# EAGLE design addr-bl (EAGLE 7.5.0)
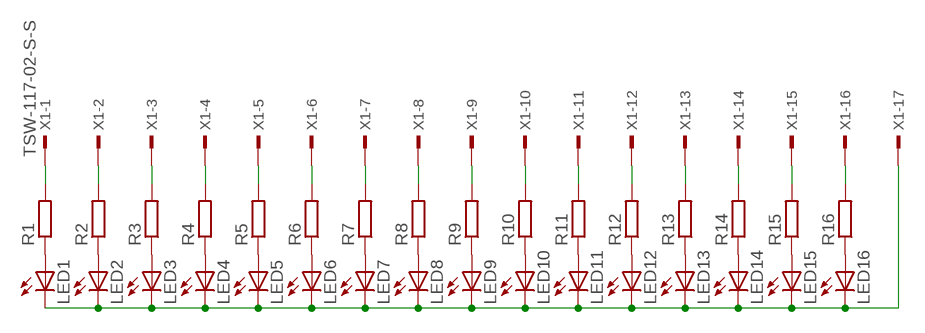
[diagram p0: schematic, sheet 1]

## Parts
LED1  LEDSMT1206  [1206]
LED2  LEDSMT1206  [1206]
LED3  LEDSMT1206  [1206]
LED4  LEDSMT1206  [1206]
LED5  LEDSMT1206  [1206]
LED6  LEDSMT1206  [1206]
LED7  LEDSMT1206  [1206]
LED8  LEDSMT1206  [1206]
LED9  LEDSMT1206  [1206]
LED10  LEDSMT1206  [1206]
LED11  LEDSMT1206  [1206]
LED12  LEDSMT1206  [1206]
LED13  LEDSMT1206  [1206]
LED14  LEDSMT1206  [1206]
LED15  LEDSMT1206  [1206]
LED16  LEDSMT1206  [1206]
R1  R-EU_M1206  [M1206]
R2  R-EU_M1206  [M1206]
R3  R-EU_M1206  [M1206]
R4  R-EU_M1206  [M1206]
R5  R-EU_M1206  [M1206]
R6  R-EU_M1206  [M1206]
R7  R-EU_M1206  [M1206]
R8  R-EU_M1206  [M1206]
R9  R-EU_M1206  [M1206]
R10  R-EU_M1206  [M1206]
R11  R-EU_M1206  [M1206]
R12  R-EU_M1206  [M1206]
R13  R-EU_M1206  [M1206]
R14  R-EU_M1206  [M1206]
R15  R-EU_M1206  [M1206]
R16  R-EU_M1206  [M1206]
X1  TSW-117-02-S-S  [TSW-117-02-S-S]

## Nets
GND: LED1.C LED2.C LED3.C LED4.C LED5.C LED6.C LED7.C LED8.C LED9.C LED10.C LED11.C LED12.C LED13.C LED14.C LED15.C LED16.C X1.17
N$1: LED1.A R1.1
N$2: LED2.A R2.1
N$3: LED3.A R3.1
N$4: LED4.A R4.1
N$5: LED5.A R5.1
N$6: LED6.A R6.1
N$7: LED7.A R7.1
N$8: LED8.A R8.1
N$9: LED9.A R9.1
N$10: LED10.A R10.1
N$11: LED11.A R11.1
N$12: LED12.A R12.1
N$13: LED13.A R13.1
N$14: LED14.A R14.1
N$15: LED15.A R15.1
N$16: LED16.A R16.1
N$18: R1.2 X1.1
N$19: R2.2 X1.2
N$20: R3.2 X1.3
N$21: R4.2 X1.4
N$22: R5.2 X1.5
N$23: R6.2 X1.6
N$24: R7.2 X1.7
N$25: R8.2 X1.8
N$26: R9.2 X1.9
N$27: R10.2 X1.10
N$28: R11.2 X1.11
N$29: R12.2 X1.12
N$30: R13.2 X1.13
N$31: R14.2 X1.14
N$32: R15.2 X1.15
N$33: R16.2 X1.16

## Library data of the parts
LED1-LED16 = led:LED: LED OSRAM: - CHIPLED LG R971, LG N971, LY N971, LG Q971, LY Q971, LO R971, LY R971 LH N974, LH R974 LS Q976, LO Q976, LY Q976 LO Q996 - Hyper CHIPLED LW Q18S LB Q993, LB Q99A, LB R99A - SideLED LS A670, LO A670, LY A670, LG A670, LP A670 LB A673, LV A673, LT A673, LW A673 LH A674 LY A675 LS A676, LA A676, LO A676, LY A676, LW A676 LS A679, LY A679, LG A679 - Hyper Micro SIDELED® LS Y876, LA Y876, LO Y876, LY Y876 LT Y87S - SmartLED LW L88C, LW L88S LB L89C, LB L89S, LG L890 LS L89K, LO L89K, LY L89K LS L896, LA L896, LO L896, LY L896 - TOPLED LS T670, LO T670, LY T670, LG T670, LP T670 LSG T670, LSP T670, LSY T670, LOP T670, LYG T670 LG T671, LOG T671, LSG T671 LB T673, LV T673, LT T673, LW T673 LH T674 LS T676, LA T676, LO T676, LY T676, LB T676, LH T676, LSB T676, LW T676 LB T67C, LV T67C, LT T67C, LS T67K, LO T67K, LY T67K, LW E67C LS E67B, LA E67B, LO E67B, LY E67B, LB E67C, LV E67C, LT E67C LW T67C LS T679, LY T679, LG T679 LS T770, LO T770, LY T770, LG T770, LP T770 LB T773, LV T773, LT T773, LW T773 LH T774 LS E675, LA E675, LY E675, LS T675 LS T776, LA T776, LO T776, LY T776, LB T776 LHGB T686 LT T68C, LB T68C - Hyper Mini TOPLED® LB M676 - Mini TOPLED Santana® LG M470 LS M47K, LO M47K, LY M47K Source: http://www.osram.convergy.de LUXEON: - LUMILED® LXK2-PW12-R00, LXK2-PW12-S00, LXK2-PW14-U00, LXK2-PW14-V00 LXK2-PM12-R00, LXK2-PM12-S00, LXK2-PM14-U00 LXK2-PE12-Q00, LXK2-PE12-R00, LXK2-PE12-S00, LXK2-PE14-T00, LXK2-PE14-U00 LXK2-PB12-K00, LXK2-PB12-L00, LXK2-PB12-M00, LXK2-PB14-N00, LXK2-PB14-P00, LXK2-PB14-Q00 LXK2-PR12-L00, LXK2-PR12-M00, LXK2-PR14-Q00, LXK2-PR14-R00 LXK2-PD12-Q00, LXK2-PD12-R00, LXK2-PD12-S00 LXK2-PH12-R00, LXK2-PH12-S00 LXK2-PL12-P00, LXK2-PL12-Q00, LXK2-PL12-R00 Source: www.luxeon.com KINGBRIGHT: KA-3528ASYC Source: www.kingbright.com
R1-R16 = rcl:R-EU_: RESISTOR, European symbol
X1 = con-samtec:TSW-117-02-S-S: THROUGH-HOLE .025" SQ POST HEADER Source: Samtec TSW.pdf; OC_FARNELL: unknown; OC_NEWARK: unknown

## Board
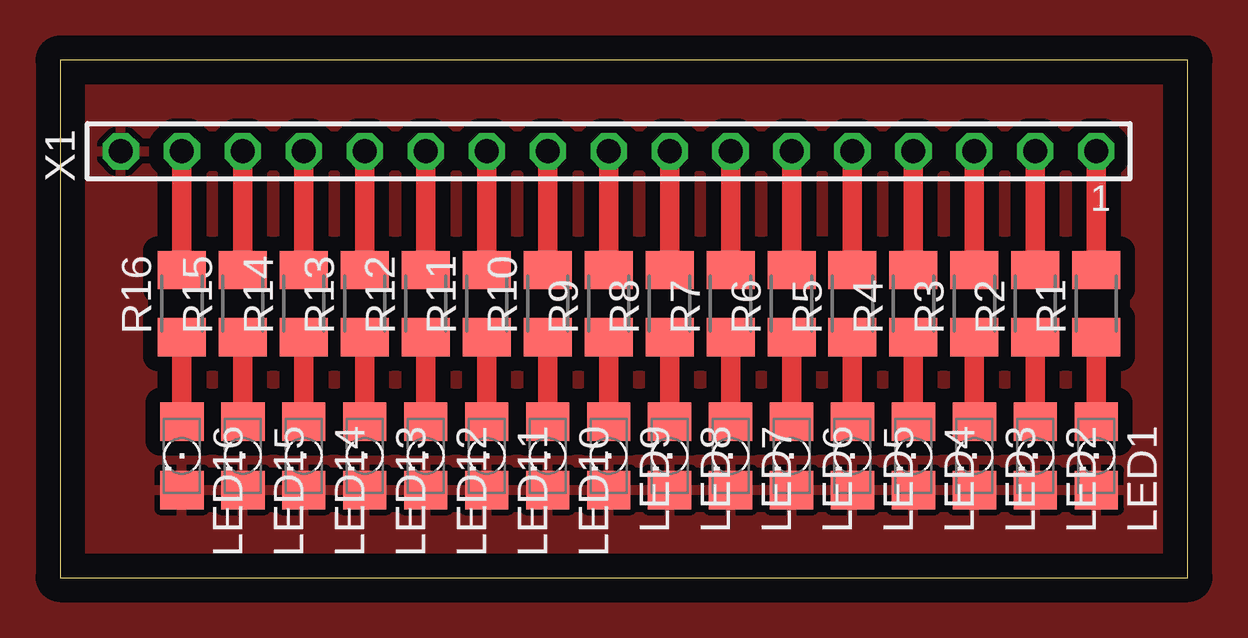
[diagram p1: board, top side]

Size 46.99 x 21.59 mm. Coordinates in mm from the lower left corner, seen from the top.
Outline: 0,0 46.99,0 46.99,21.59 0,21.58 0,0
Copper layers (1*16): Top 0.035mm / dielectric 1.5mm / Bottom 0.035mm
Design rules "default": minimum track width 10mil, minimum drill 24mil, track to track 8mil, track to pad 8mil, pad to pad 8mil, via to via 8mil, smd to smd 8mil, copper to edge 40mil, drill to drill 8mil, minimum pad ring 10mil, minimum via ring 8mil, stop-mask expansion 4mil, vias tented up to drill 0mil, thermal gap 10mil

### Footprints (pad centres in the part's own frame; a part is rotated, then mirrored left to right if it is on the bottom)
1206 = smd 1.6 x 1.803: A -1.422,0; C 1.422,0
M1206 = smd 1.6 x 2: 1 -1.4,0; 2 1.4,0
TSW-117-02-S-S = drill 1 pad 1.5 octagon: 1 20.32,0; 2 17.78,0; 3 15.24,0; 4 12.7,0; 5 10.16,0; 6 7.62,0; 7 5.08,0; 8 2.54,0; 9 0,0; 10 -2.54,0; 11 -5.08,0; 12 -7.62,0; 13 -10.16,0; 14 -12.7,0; 15 -15.24,0; 16 -17.78,0; 17 -20.32,0

### Placement (x,y rotation side)
LED1  43.18,5.08 270 top
LED2  40.64,5.08 270 top
LED3  38.1,5.08 270 top
LED4  35.56,5.08 270 top
LED5  33.02,5.08 270 top
LED6  30.48,5.08 270 top
LED7  27.94,5.08 270 top
LED8  25.4,5.08 270 top
LED9  22.86,5.08 270 top
LED10  20.32,5.08 270 top
LED11  17.78,5.08 270 top
LED12  15.24,5.08 270 top
LED13  12.7,5.08 270 top
LED14  10.16,5.08 270 top
LED15  7.62,5.08 270 top
LED16  5.08,5.08 270 top
R1  43.18,11.43 90 top
R2  40.64,11.43 90 top
R3  38.1,11.43 90 top
R4  35.56,11.43 90 top
R5  33.02,11.43 90 top
R6  30.48,11.43 90 top
R7  27.94,11.43 90 top
R8  25.4,11.43 90 top
R9  22.86,11.43 90 top
R10  20.32,11.43 90 top
R11  17.78,11.43 90 top
R12  15.24,11.43 90 top
R13  12.7,11.43 90 top
R14  10.16,11.43 90 top
R15  7.62,11.43 90 top
R16  5.08,11.43 90 top
X1  22.86,17.78 0 top

### Tracks (layer width: path | path; a pad name or v marks a point on that pad's centre or on a via)
GND
  pour Top (isolate 0.61): -6.35,27.94 53.34,27.94 53.34,-6.35 -6.35,-6.35
N$1
  Top 0.813: R1.1 LED1.A
N$2
  Top 0.813: LED2.A R2.1
N$3
  Top 0.813: R3.1 LED3.A
N$4
  Top 0.813: LED4.A R4.1
N$5
  Top 0.813: R5.1 LED5.A
N$6
  Top 0.813: LED6.A R6.1
N$7
  Top 0.813: R7.1 LED7.A
N$8
  Top 0.813: LED8.A R8.1
N$9
  Top 0.813: LED9.A R9.1
N$10
  Top 0.813: R10.1 LED10.A
N$11
  Top 0.813: LED11.A R11.1
N$12
  Top 0.813: R12.1 LED12.A
N$13
  Top 0.813: LED13.A R13.1
N$14
  Top 0.813: R14.1 LED14.A
N$15
  Top 0.813: LED15.A R15.1
N$16
  Top 0.813: R16.1 LED16.A
N$18
  Top 0.813: X1.1 R1.2
N$19
  Top 0.813: R2.2 X1.2
N$20
  Top 0.813: X1.3 R3.2
N$21
  Top 0.813: R4.2 X1.4
N$22
  Top 0.813: X1.5 R5.2
N$23
  Top 0.813: X1.6 R6.2
N$24
  Top 0.813: R7.2 X1.7
N$25
  Top 0.813: X1.8 R8.2
N$26
  Top 0.813: R9.2 X1.9
N$27
  Top 0.813: X1.10 R10.2
N$28
  Top 0.813: R11.2 X1.11
N$29
  Top 0.813: X1.12 R12.2
N$30
  Top 0.813: R13.2 X1.13
N$31
  Top 0.813: X1.14 R14.2
N$32
  Top 0.813: R15.2 X1.15
N$33
  Top 0.813: X1.16 R16.2